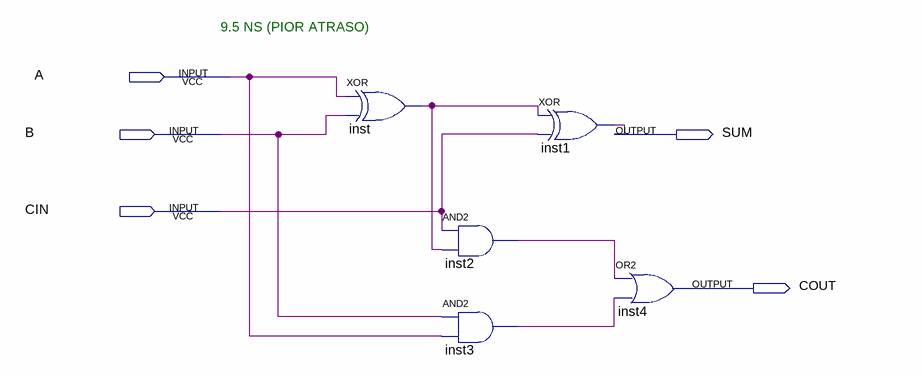
[diagram p0: schematic sheet]
// Quartus schematic PULL_ADDER_1BIT.bdf as structural Verilog: 5 symbols, 5 pins
module PULL_ADDER_1BIT (
  input  A,
  input  B,
  input  CIN,
  output SUM,
  output COUT
);

  wire inst2_out, inst3_out, inst_out;

  xor inst (inst_out, A, B);
  and inst2 (inst2_out, CIN, inst_out);
  and inst3 (inst3_out, B, A);
  xor inst1 (SUM, inst_out, CIN);
  or inst4 (COUT, inst2_out, inst3_out);

  // Notes on the sheet:
  //   9.5 NS (PIOR ATRASO)
endmodule
